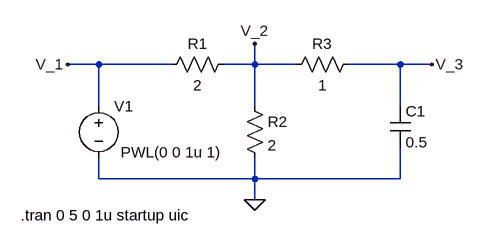
[diagram p0: schematic Project_2_Transient_Tutorial.asc]
Project_2_Transient_Tutorial.asc, the LTspice schematic file:
Version 4
SHEET 1 880 680
WIRE -16 96 -64 96
WIRE 96 96 -16 96
WIRE 224 96 224 64
WIRE 224 96 176 96
WIRE 288 96 224 96
WIRE 448 96 368 96
WIRE 496 96 448 96
WIRE -16 160 -16 96
WIRE 224 160 224 96
WIRE 448 160 448 96
WIRE -16 272 -16 240
WIRE 224 272 224 240
WIRE 224 272 -16 272
WIRE 448 272 448 224
WIRE 448 272 224 272
WIRE 224 304 224 272
FLAG 224 304 0
FLAG 224 64 V_2
FLAG -64 96 V_1
FLAG 496 96 V_3
SYMBOL res 80 112 R270
WINDOW 0 32 56 VTop 2
WINDOW 3 0 56 VBottom 2
SYMATTR InstName R1
SYMATTR Value 2
SYMBOL res 208 144 R0
SYMATTR InstName R2
SYMATTR Value 2
SYMBOL res 272 112 R270
WINDOW 0 32 56 VTop 2
WINDOW 3 0 56 VBottom 2
SYMATTR InstName R3
SYMATTR Value 1
SYMBOL cap 432 160 R0
SYMATTR InstName C1
SYMATTR Value 0.5
SYMBOL voltage -16 144 R0
WINDOW 3 34 87 Left 2
WINDOW 123 0 0 Left 2
WINDOW 39 0 0 Left 2
SYMATTR Value PWL(0 0 1u 1)
SYMATTR InstName V1
TEXT -136 328 Left 2 !.tran 0 5 0 1u startup uic

The netlist it stands for:
* Project_2_Transient_Tutorial.asc
R1 V_1 V_2 2
R2 V_2 0 2
R3 V_2 V_3 1
C1 V_3 0 0.5
V1 V_1 0 PWL(0 0 1u 1)
.tran 0 5 0 1u startup uic
.backanno
.end

* Results of the author's LTspice run, read from the files saved beside the schematic
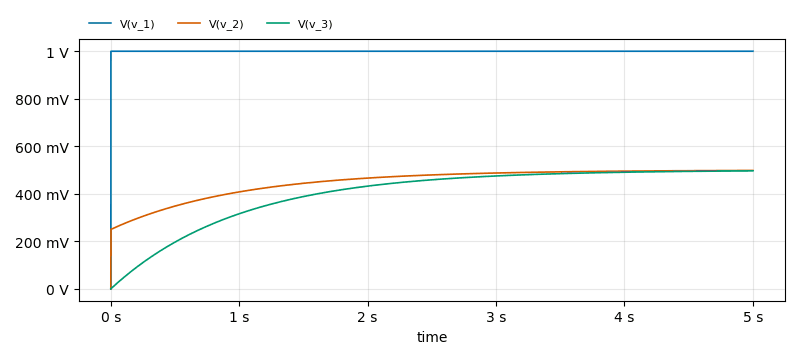
[diagram p1: Transient Analysis of Project_2_Transient_Tutorial.asc, plotted from the saved traces]
* Transient Analysis, 1 run:
*   V(v_1): min 0 V, max 1 V, average 1 V, rms 1 V, last 1 V
*   V(v_2): min 0 V, max 498.3 mV, average 450.3 mV, rms 454.5 mV, last 498.3 mV
*   V(v_3): min 0 V, max 496.6 mV, average 400.7 mV, rms 419.1 mV, last 496.6 mV